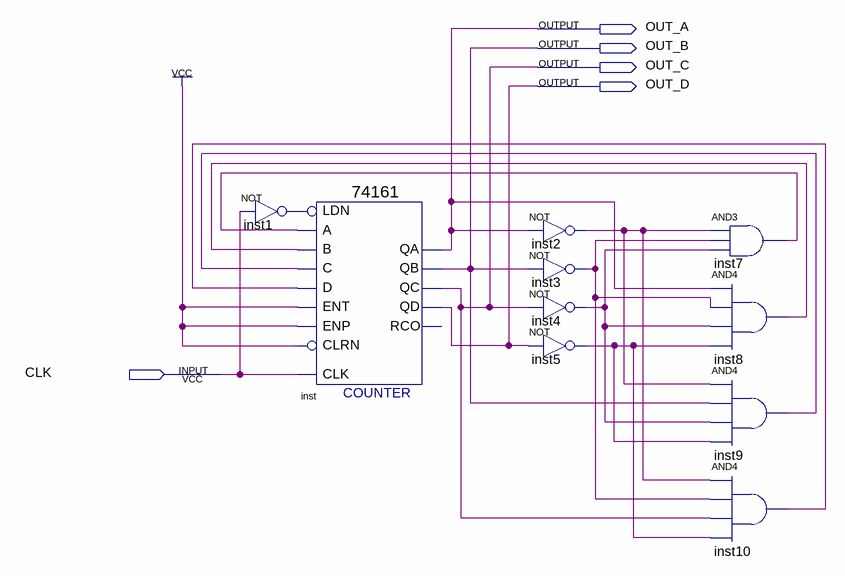
[diagram p0: schematic sheet]
// Quartus schematic Circular_74161.bdf as structural Verilog: 10 symbols, 5 pins
module Circular_74161 (
  input  CLK,
  output OUT_A,
  output OUT_B,
  output OUT_C,
  output OUT_D
);

  wire inst1_out, inst2_out, inst3_out, inst4_out, inst5_out, inst7_out, inst8_out, inst9_out, inst10_out;

  not inst1 (inst1_out, CLK);
  \74161  inst (
    .CLRN(1'b1), .CLK(CLK), .ENP(1'b1), .LDN(inst1_out), .A(inst7_out), .D(inst10_out), .ENT(1'b1),
    .B(inst8_out), .C(inst9_out), .QD(OUT_D), .QC(OUT_C), .QB(OUT_B), .QA(OUT_A));  // open: RCO
  not inst2 (inst2_out, OUT_A);
  not inst3 (inst3_out, OUT_B);
  not inst4 (inst4_out, OUT_C);
  not inst5 (inst5_out, OUT_D);
  and inst7 (inst7_out, inst2_out, inst3_out, inst4_out);
  and inst8 (inst8_out, OUT_A, inst3_out, inst4_out, inst5_out);
  and inst9 (inst9_out, inst2_out, OUT_B, inst4_out, inst5_out);
  and inst10 (inst10_out, inst2_out, inst3_out, OUT_C, inst5_out);
endmodule
